# Altium schematic sheet jetson-nano.SchDoc
size A3
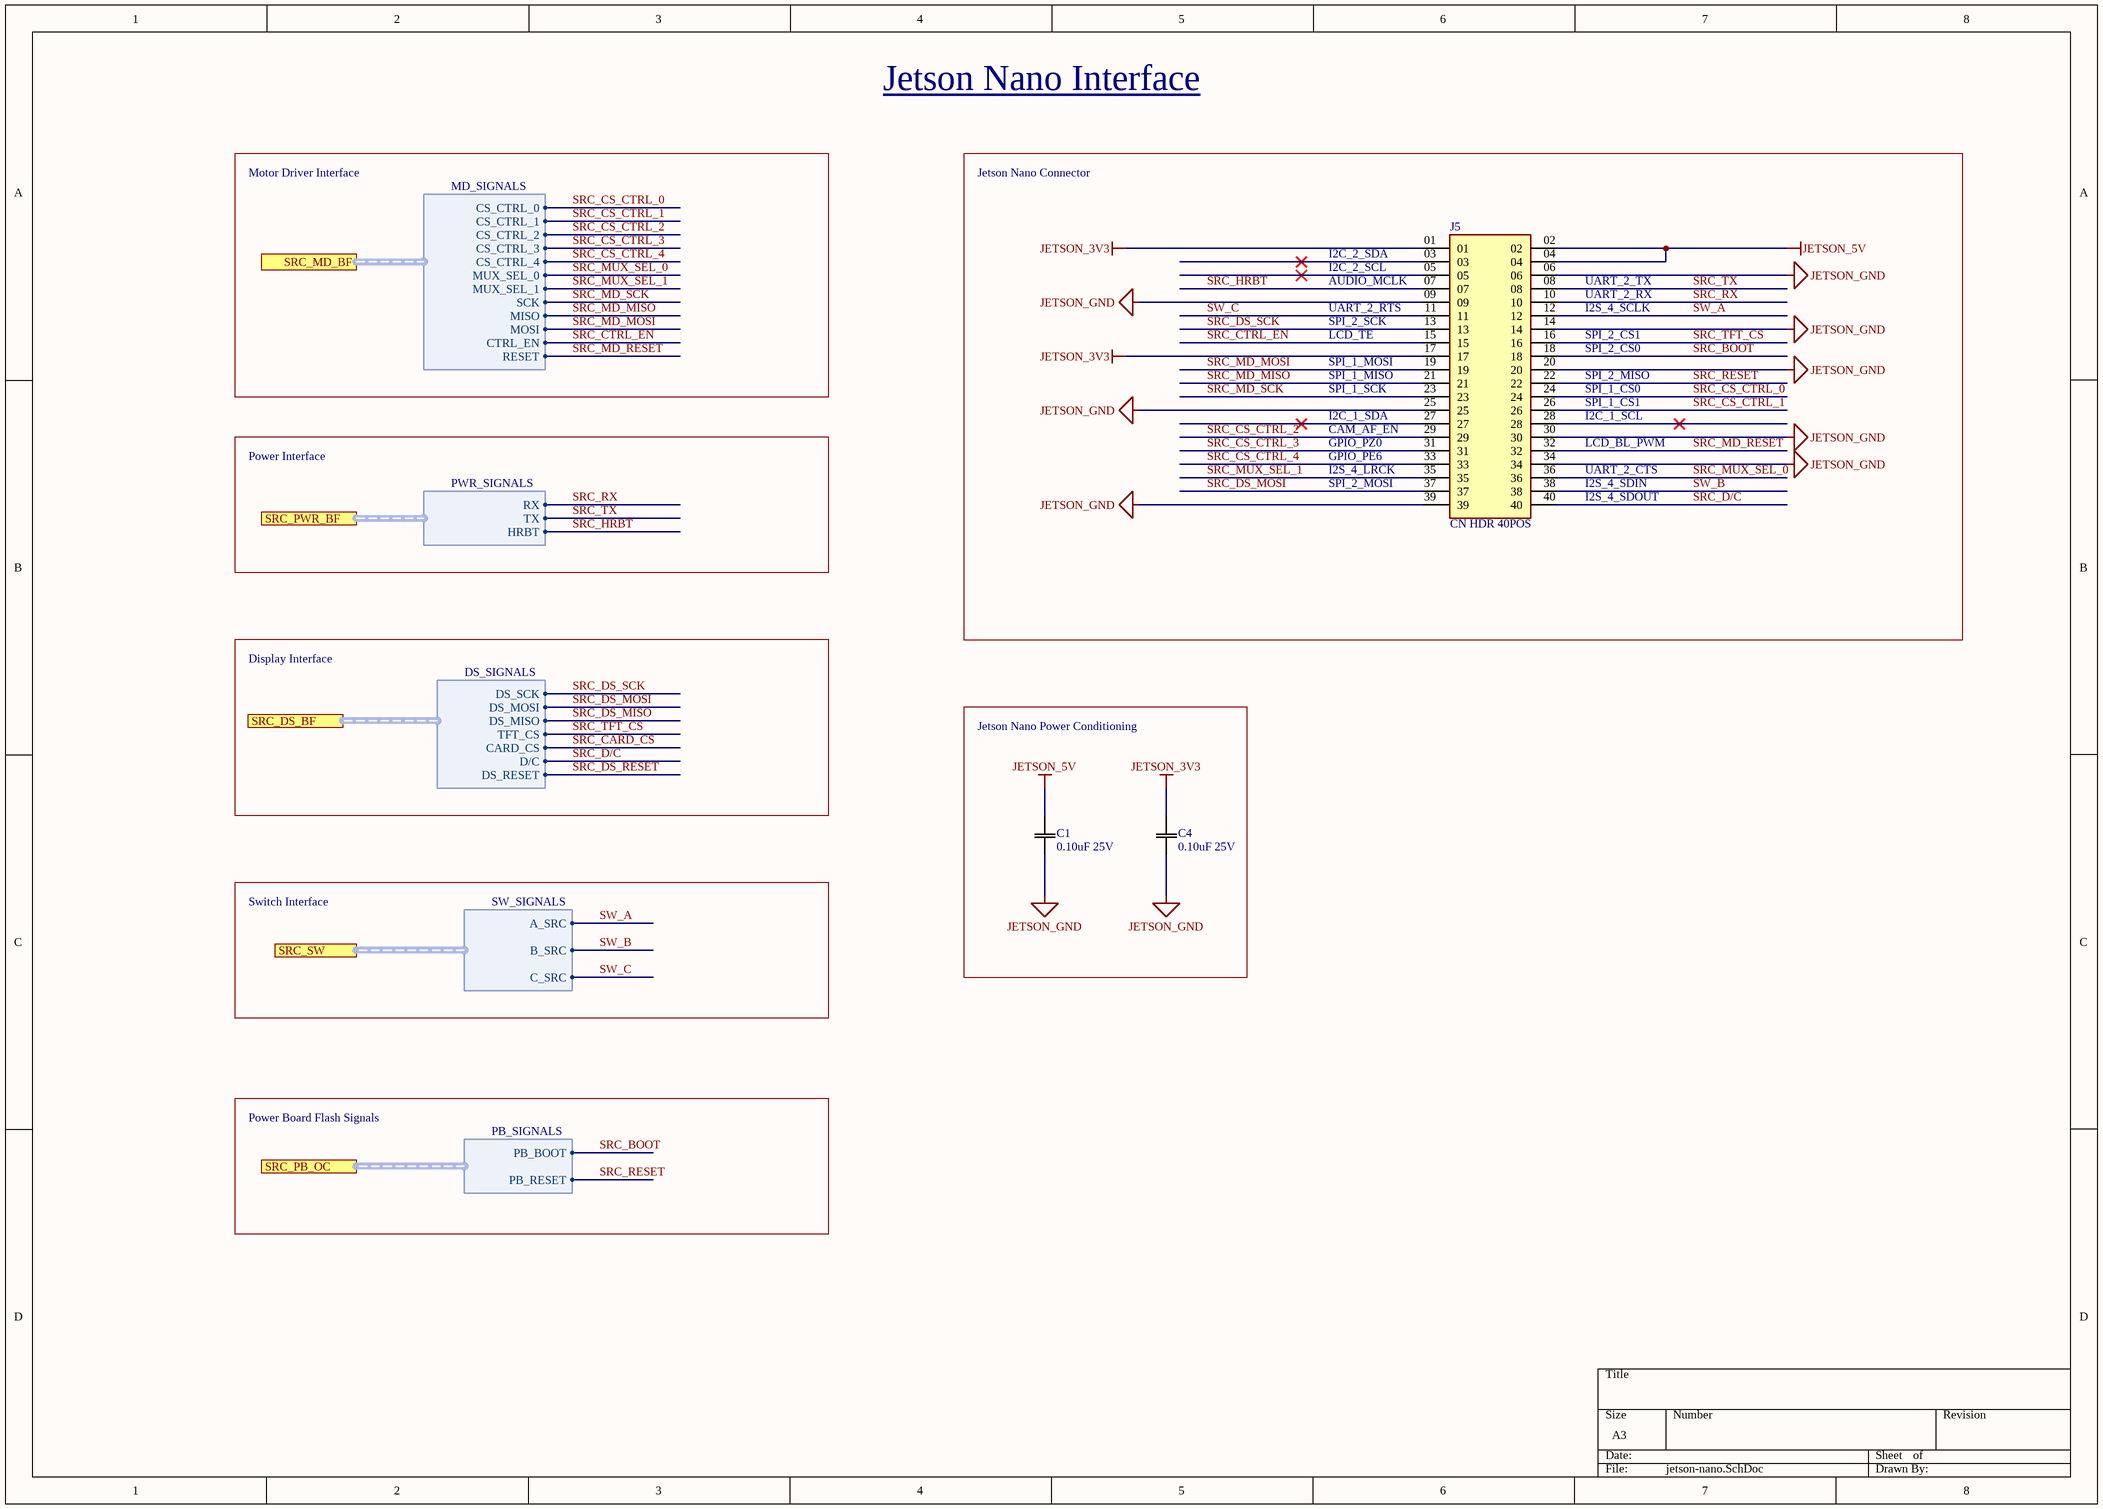
[diagram p0: jetson-nano.SchDoc]

## Parts
C1  0.10uF 25V  [0805]
C4  0.10uF 25V  [0805]
J5  CN HDR 40POS  [CN HDR 40POS 0.1 TH]

## Blocks framed on the sheet
Jetson Nano Power Conditioning: C1 C4

## Ports
SRC_DS_BF (harness DS_SIGNALS), SRC_MD_BF (harness MD_SIGNALS), SRC_PB_OC (harness PB_SIGNALS), SRC_PWR_BF (harness PWR_SIGNALS), SRC_SW (harness SW_SIGNALS)

## Harnesses
PWR_SIGNALS: TX, RX, HRBT
MD_SIGNALS: CS_CTRL_0, MUX_SEL_1, SCK, MOSI, MISO, CS_CTRL_1, CS_CTRL_2, CS_CTRL_3, CS_CTRL_4, MUX_SEL_0, CTRL_EN, RESET
DS_SIGNALS: DS_SCK, DS_MOSI, DS_MISO, TFT_CS, CARD_CS, D/C, DS_RESET
SW_SIGNALS: A_SRC, B_SRC, C_SRC
PB_SIGNALS: PB_BOOT, PB_RESET

## Nets
JETSON_3V3: C4.2(C2) J5.01 J5.17
JETSON_5V: C1.2(C2) J5.02 J5.04
JETSON_GND: C1.1(C1) C4.1(C1) J5.06 J5.09 J5.14 J5.20 J5.25 J5.30 J5.34 J5.39
SRC_BOOT: J5.18 ; port SRC_PB_OC.PB_BOOT
SRC_CARD_CS: port SRC_DS_BF.CARD_CS
SRC_CS_CTRL_0: J5.24 ; port SRC_MD_BF.CS_CTRL_0
SRC_CS_CTRL_1: J5.26 ; port SRC_MD_BF.CS_CTRL_1
SRC_CS_CTRL_2: J5.29 ; port SRC_MD_BF.CS_CTRL_2
SRC_CS_CTRL_3: J5.31 ; port SRC_MD_BF.CS_CTRL_3
SRC_CS_CTRL_4: J5.33 ; port SRC_MD_BF.CS_CTRL_4
SRC_CTRL_EN: J5.15 ; port SRC_MD_BF.CTRL_EN
SRC_D/C: J5.40 ; port SRC_DS_BF.D/C
SRC_DS_MISO: port SRC_DS_BF.DS_MISO
SRC_DS_MOSI: J5.37 ; port SRC_DS_BF.DS_MOSI
SRC_DS_RESET: port SRC_DS_BF.DS_RESET
SRC_DS_SCK: J5.13 ; port SRC_DS_BF.DS_SCK
SRC_HRBT: J5.07 ; port SRC_PWR_BF.HRBT
SRC_MD_MISO: J5.21 ; port SRC_MD_BF.MISO
SRC_MD_MOSI: J5.19 ; port SRC_MD_BF.MOSI
SRC_MD_RESET: J5.32 ; port SRC_MD_BF.RESET
SRC_MD_SCK: J5.23 ; port SRC_MD_BF.SCK
SRC_MUX_SEL_0: J5.36 ; port SRC_MD_BF.MUX_SEL_0
SRC_MUX_SEL_1: J5.35 ; port SRC_MD_BF.MUX_SEL_1
SRC_RESET: J5.22 ; port SRC_PB_OC.PB_RESET
SRC_RX: J5.10 ; port SRC_PWR_BF.RX
SRC_TFT_CS: J5.16 ; port SRC_DS_BF.TFT_CS
SRC_TX: J5.08 ; port SRC_PWR_BF.TX
SW_A: J5.12 ; port SRC_SW.A_SRC
SW_B: J5.38 ; port SRC_SW.B_SRC
SW_C: J5.11 ; port SRC_SW.C_SRC

Not connected (* = marked no-connect by the designer): J5 03* 05* 27* 28*

## Notes on the sheet
- Jetson Nano Interface
- Motor Driver Interface
- Jetson Nano Connector
- AUDIO_MCLK
- UART_2_RTS
- I2C_2_SDA
- I2C_2_SCL
- I2S_4_SCLK
- UART_2_TX
- UART_2_RX
- LCD_TE
- SPI_2_SCK
- SPI_1_MOSI
- SPI_1_MISO
- SPI_2_CS1
- SPI_2_MISO
- SPI_2_CS0
- GPIO_PZ0
- CAM_AF_EN
- SPI_1_SCK
- I2C_1_SDA
- LCD_BL_PWM
- SPI_1_CS0
- SPI_1_CS1
- I2C_1_SCL
- Power Interface
- SPI_2_MOSI
- I2S_4_LRCK
- GPIO_PE6
- I2S_4_SDIN
- UART_2_CTS
- I2S_4_SDOUT
- Display Interface
- Switch Interface
- Power Board Flash Signals

## Library data of the parts
C1 C4 = CAP 0.10uF 25V: CAP CER 0.10UF 25V X7R 0805; Value: 0.1uF; Tolerance: 10%; Temperature Coefficient: X7R; Rating: 25V; Part Number: CAP 0.10uF 25V; Operating Temperature: -55°C ~ 125°C
J5 = CN HDR 40POS: 40 Position Header Connector; Part Number: CN HDR 40POS; Supplier 1: Digi-Key; Supplier Part Number 1: S6104-ND; Supplier URL 1: https://www.digikey.ca/en/products/detail/sullins-connector-solutions/PPTC202LFBN-RC/807240?s=N4IgTCBcDaIMoDYCMAGALAWgHIBEQF0BfIA; Pin Count: 40